# EAGLE design mySatellite_STM (EAGLE 7.6.0)
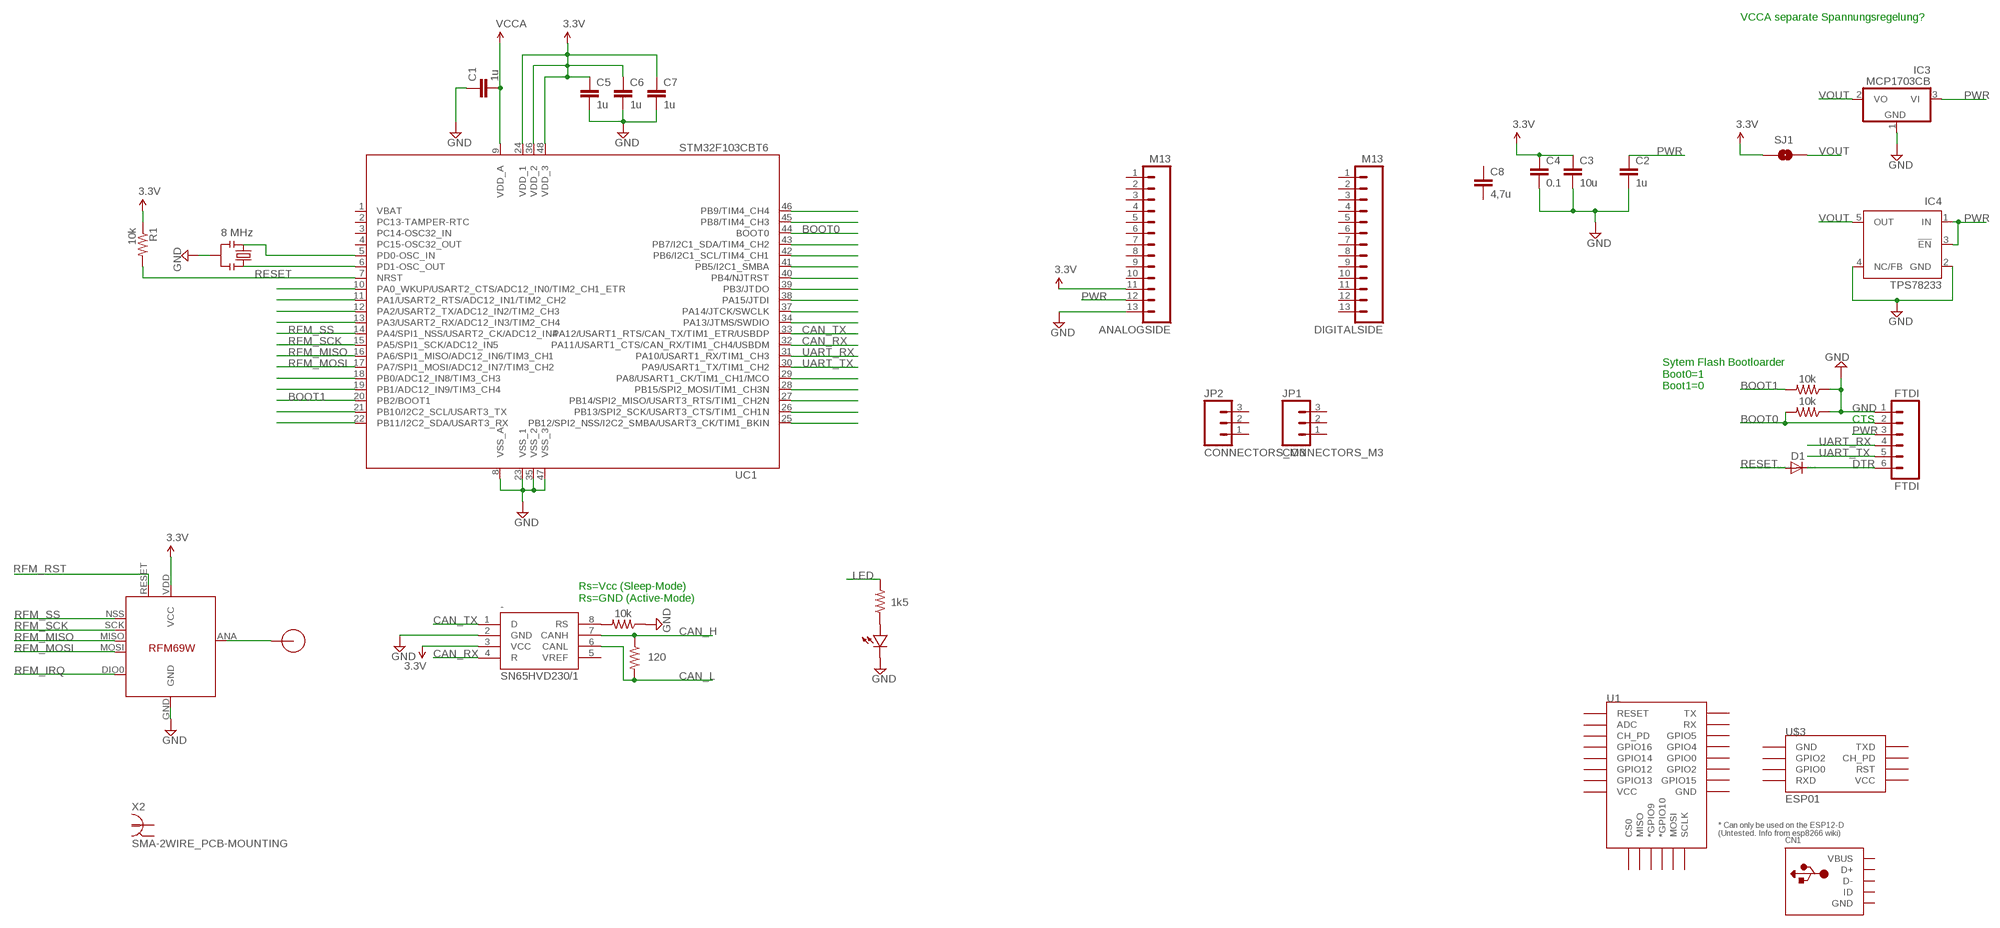
[diagram p0: schematic, sheet 1]

## Parts
-  SN65HVD230/1  [SO8]
ANALOGSIDE  M13  [1X13]
C1  1u  CAP0603-CAP  [0603-CAP]
C2  1u  CAP0603-CAP  [0603-CAP]
C3  10u  CAP0805-CAP  [0805-CAP]
C4  0.1  CAP0603-CAP  [0603-CAP]
C5  1u  CAP0603-CAP  [0603-CAP]
C6  1u  CAP0603-CAP  [0603-CAP]
C7  1u  CAP0603-CAP  [0603-CAP]
C8  4,7u  CAP0805-CAP  [0805-CAP]
CN1  USBMINIB  [USB-MINIB]
D1  DIODE-SOD323-R  [SOD323-R]
DIGITALSIDE  M13  [1X13]
FTDI  FTDI  M06SIP  [1X06]
IC3  MCP1703CB  [SOT23]
IC4  TPS78233  TPS77001  [SOT23-DBV]
JP1  CONNECTORS_M3  [CONNECTORS_1X3]
JP2  CONNECTORS_M3  [CONNECTORS_1X3]
R1  10k  RESISTOR0603-RES  [0603-RES]
R2  1k5  RESISTOR0603-RES  [0603-RES]
R3  10k  RESISTOR0603-RES  [0603-RES]
R4  120  RESISTOR0603-RES  [0603-RES]
R5  10k  RESISTOR0603-RES  [0603-RES]
R7  10k  RESISTOR0603-RES  [0603-RES]
SJ1  SOLDERJUMPERTRACE  [SJ_2S-TRACE]
U1  ESP12ESMD  [ESP12E-SMD]
U$1  RFM12B_ANTENNA  [RFM12B-ANTENNA]
U$2  LED0603  [0603-LED]
U$3  ESP01  [ESP01]
U$5  RFM69_MINIPADS  [RFM69W-MINPADS]
UC1  STM32F103CBT6  STM32F103CB  [LQFP48]
X1  8 MHz  RESONATORSMD  [RESONATOR-SMD]
X2  SMA-2WIRE_PCB-MOUNTING  [J01151A0931]

## Nets
BOOT0: FTDI.2 R5.2 UC1.44(BOOT0)
BOOT1: R7.2 UC1.20(PB2/BOOT1)
CAN_H: -.7(CANH) R4.1
CAN_L: -.6(CANL) R4.2
CAN_RX: -.4(R) UC1.32(PA11/USART1_CTS/CAN_RX/TIM1_CH4/USBDM)
CAN_TX: -.1(D) UC1.33(PA12/USART1_RTS/CAN_TX/TIM1_ETR/USBDP)
DTR: D1.C FTDI.6
GND [power]: -.2(GND) ANALOGSIDE.13 C1.1 C2.2 C3.2 C4.2 C5.2 C6.2 C7.2 FTDI.1 IC3.1(GND) IC4.2(GND) IC4.4(NC/FB) R3.1 R5.1 R7.1 U$2.MINUS U$5.GND UC1.8(VSS_A) UC1.23(VSS_1) UC1.35(VSS_2) UC1.47(VSS_3) X1.2
LED: R2.2
N$1: UC1.29(PA8/USART1_CK/TIM1_CH1/MCO)
N$2: R2.1 U$2.PLUS
N$3: U$1.P$1 U$5.ANA(ANT)
N$4: C1.2 UC1.9(VDD_A) ; supply symbol labelled VCCA
N$5: UC1.45(PB8/TIM4_CH3)
N$6: UC1.5(PD0-OSC_IN) X1.1
N$7: -.8(RS) R3.2
N$8: UC1.6(PD1-OSC_OUT) X1.3
N$9: UC1.34(PA13/JTMS/SWDIO)
N$10: UC1.37(PA14/JTCK/SWCLK)
N$11: UC1.38(PA15/JTDI)
N$12: UC1.28(PB15/SPI2_MOSI/TIM1_CH3N)
N$13: UC1.27(PB14/SPI2_MISO/USART3_RTS/TIM1_CH2N)
N$14: UC1.26(PB13/SPI2_SCK/USART3_CTS/TIM1_CH1N)
N$15: UC1.25(PB12/SPI2_NSS/I2C2_SMBA/USART3_CK/TIM1_BKIN)
N$16: UC1.39(PB3/JTDO)
N$17: UC1.40(PB4/NJTRST)
N$18: UC1.41(PB5/I2C1_SMBA)
N$19: UC1.42(PB6/I2C1_SCL/TIM4_CH1)
N$20: UC1.43(PB7/I2C1_SDA/TIM4_CH2)
N$21: UC1.46(PB9/TIM4_CH4)
N$22: UC1.21(PB10/I2C2_SCL/USART3_TX)
N$23: UC1.22(PB11/I2C2_SDA/USART3_RX)
N$24: UC1.19(PB1/ADC12_IN9/TIM3_CH4)
N$25: UC1.18(PB0/ADC12_IN8/TIM3_CH3)
N$26: UC1.13(PA3/USART2_RX/ADC12_IN3/TIM2_CH4)
N$27: UC1.12(PA2/USART2_TX/ADC12_IN2/TIM2_CH3)
N$28: UC1.11(PA1/USART2_RTS/ADC12_IN1/TIM2_CH2)
N$29: UC1.10(PA0_WKUP/USART2_CTS/ADC12_IN0/TIM2_CH1_ETR)
PWR [power]: ANALOGSIDE.12 C2.1 FTDI.3 IC3.3(VI) IC4.1(IN) IC4.3(!EN)
RESET: D1.A R1.2 UC1.7(NRST)
RFM_IRQ: U$5.DIO0(DIO0/IRQ)
RFM_MISO: U$5.MISO UC1.16(PA6/SPI1_MISO/ADC12_IN6/TIM3_CH1)
RFM_MOSI: U$5.MOSI UC1.17(PA7/SPI1_MOSI/ADC12_IN7/TIM3_CH2)
RFM_RST: U$5.RESET
RFM_SCK: U$5.SCK UC1.15(PA5/SPI1_SCK/ADC12_IN5)
RFM_SS: U$5.NSS(SEL) UC1.14(PA4/SPI1_NSS/USART2_CK/ADC12_IN4)
UART_RX: FTDI.4 UC1.31(PA10/USART1_RX/TIM1_CH3)
UART_TX: FTDI.5 UC1.30(PA9/USART1_TX/TIM1_CH2)
VCC: -.3(VCC) ANALOGSIDE.11 C3.1 C4.1 C5.1 C6.1 C7.1 R1.1 SJ1.1 U$5.VDD(VCC) UC1.24(VDD_1) UC1.36(VDD_2) UC1.48(VDD_3) ; supply symbol labelled 3.3V
VOUT: IC3.2(VO) IC4.5(OUT) SJ1.2
Unconnected: -.5(VREF) ANALOGSIDE.1 ANALOGSIDE.2 ANALOGSIDE.3 ANALOGSIDE.4 ANALOGSIDE.5 ANALOGSIDE.6 ANALOGSIDE.7 ANALOGSIDE.8 ANALOGSIDE.9 ANALOGSIDE.10 C8.1 C8.2 CN1.D+ CN1.D- CN1.ID DIGITALSIDE.1 DIGITALSIDE.2 DIGITALSIDE.3 DIGITALSIDE.4 DIGITALSIDE.5 DIGITALSIDE.6 DIGITALSIDE.7 DIGITALSIDE.8 DIGITALSIDE.9 DIGITALSIDE.10 DIGITALSIDE.11 DIGITALSIDE.12 DIGITALSIDE.13 JP1.1 JP1.2 JP1.3 JP2.1 JP2.2 JP2.3 U1.ADC U1.CH_PD U1.CS0 U1.GND U1.GPIO0 U1.GPIO2 U1.GPIO4 U1.GPIO5 U1.GPIO9(*GPIO9) U1.GPIO10(*GPIO10) U1.GPIO12 U1.GPIO13 U1.GPIO14 U1.GPIO15 U1.GPIO16 U1.MISO U1.MOSI U1.RESET U1.RXD0(RX) U1.SCLK U1.TXD0(TX) U1.VCC U$3.CH_PD U$3.GND U$3.GPIO0 U$3.GPIO2 U$3.RST U$3.RX(RXD) U$3.TX(TXD) U$3.VCC UC1.2(PC13-TAMPER-RTC) UC1.3(PC14-OSC32_IN) UC1.4(PC15-OSC32_OUT) X2.1 X2.G@1 X2.G@2 X2.G@3 X2.G@4

## Notes on the sheet
- VCCA separate Spannungsregelung?
- Sytem Flash Bootloarder
  Boot0=1
  Boot1=0
- CTS
- Rs=Vcc (Sleep-Mode)
  Rs=GND (Active-Mode)

## Power pins joined to a net without a drawn wire
GND: CN1.GND
VBAT: UC1.1(VBAT)
VBUS: CN1.VBUS

## Library data of the parts
- = texas_instruments:SN65HVD230/1; EBAY: SN65HVD231
ANALOGSIDE DIGITALSIDE = SparkFun-Connectors:M13: 13-pin single row .1" header; BUERKLIN: 59 F 2140
C1 C2 C5-C7 = LowPowerLab:CAP: Capacitor Standard 0603 ceramic capacitor, and 0.1" leaded capacitor.; BUERKLIN: 53D1660
C3 = LowPowerLab:CAP: Capacitor Standard 0603 ceramic capacitor, and 0.1" leaded capacitor.; BUERKLIN: 53 D 2432
C4 = LowPowerLab:CAP: Capacitor Standard 0603 ceramic capacitor, and 0.1" leaded capacitor.; BUERKLIN: 53 D 1726
C8 = LowPowerLab:CAP: Capacitor Standard 0603 ceramic capacitor, and 0.1" leaded capacitor.; BUERKLIN: 53 D 2431
CN1 = myLib:USB: USB Connectors USBMINIB - Surface Mount Female Mini-B USB Connector 4UConnector: 06564 By microbuilder.eu Thru-hole RA Female Mini-B USB Connector 4UConnector: 18732 By ladyada.net
D1 = diode:DIODE-: DIODE; BUERKLIN: 34 S 1216
FTDI = SparkFun-Connectors:M06: Header 6 Standard 6-pin 0.1" header. Use with straight break away headers (SKU : PRT-00116), right angle break away headers (PRT-00553), swiss pins (PRT-00743), machine pins (PRT-00117), and female headers (PRT-00115). Molex polarized connector foot print use with SKU : PRT-08094 with associated crimp pins and housings. NOTES ON THE VARIANTS LOCK and LOCK_LONGPADS... This footprint was designed to help hold the alignment of a through-hole component (i.e. 6-pin header) while soldering it into place. You may notice that each hole has been shifted either up or down by 0.005 of an inch from it's more standard position (which is a perfectly straight line). This slight alteration caused the pins (the squares in the middle) to touch the edges of the holes. Because they are alternating, it causes a "brace" to hold the component in place. 0.005 has proven to be the perfect amount of "off-center" position when using our standard breakaway headers. Although looks a little odd when you look at the bare footprint, once you have a header in there, the alteration is very hard to notice. Also, if you push a header all the way into place, it is covered up entirely on the bottom side. This idea of altering the position of holes to aid alignment will be further integrated into the Sparkfun Library for other footprints. It can help hold any component with 3 or more connection pins.; BUERKLIN: 59 F 2134
IC3 = linear:MCP1703: 250 mA, 16V, Low Quiescent Current LDO Regulator Source: http://ww1.microchip.com/downloads/en/DeviceDoc/22049b.pdf; CONRAD: 651422-62
IC4 = texas:TPS770*: ULTRALOW-POWER 50-mA LOW-DROPOUT LINEAR REGULATORS 50-mA Low-Dropout Regulator Source: http://focus.ti.com/lit/ds/symlink/tps77001.pdf; MF: TEXAS INSTRUMENTS; MPN: TPS77001DBVT; OC_FARNELL: 8461554; OC_NEWARK: 77C1171
JP1 JP2 = myLib:CONNECTORS_M3: 13-pin single row .1" header
R1 R3 R5 R7 = LowPowerLab:RESISTOR: Resistor Basic schematic elements and footprints for 0603, 1206, and PTH resistors.; BUERKLIN: 26 E 816
R2 = LowPowerLab:RESISTOR: Resistor Basic schematic elements and footprints for 0603, 1206, and PTH resistors.; BUERKLIN: 26 E 796
R4 = LowPowerLab:RESISTOR: Resistor Basic schematic elements and footprints for 0603, 1206, and PTH resistors.; BUERKLIN: 26 E 770
SJ1 = SparkFun-Retired:SOLDERJUMPER: Solder Jumper Standard SMD solder jumper. Used to automate production. Two varients : Normally Open and Normally Closed are the same, but have different paste layers. NC will have a large amount of paste and should jumper during reflow.
U1 = esp8266modules:ESP12E: ESP12E Module
U$1 = LowPowerLab:RFM12B_ANTENNA
U$2 = LowPowerLab:LED; BUERKLIN: 66 S 9766
U$3 = esp8266modules:ESP01: ESP8266 Wifi module 01
U$5 = myLib:RFM69_MINIPADS
UC1 = stm32:STM32F103CB; BUERKLIN_128KB: 51 S 2353; BUERKLIN_64KB: 51 S 2352
X1 = SparkFun:RESONATOR: Resonator Small SMD resonator. This is the itty bitty 10/20MHz resonators with built in caps. CSTCE10M0G55 and CSTCE20M0V53. Footprint has been reviewed closely but hasn't been tested yet.
X2 = myLib:SMA-2WIRE_PCB-MOUNTING: SMA 50 Ohm Straight Jack Receptacle - PCB Mountung www.telegaertner.de Source: Buerklin Artikelnummer: J01151A0931; BUERKLIN: 76F410

## Net classes
0 default: width 0.305 mm, clearance 0.254 mm
1 power: width 0.381 mm, clearance 0.254 mm

## Board
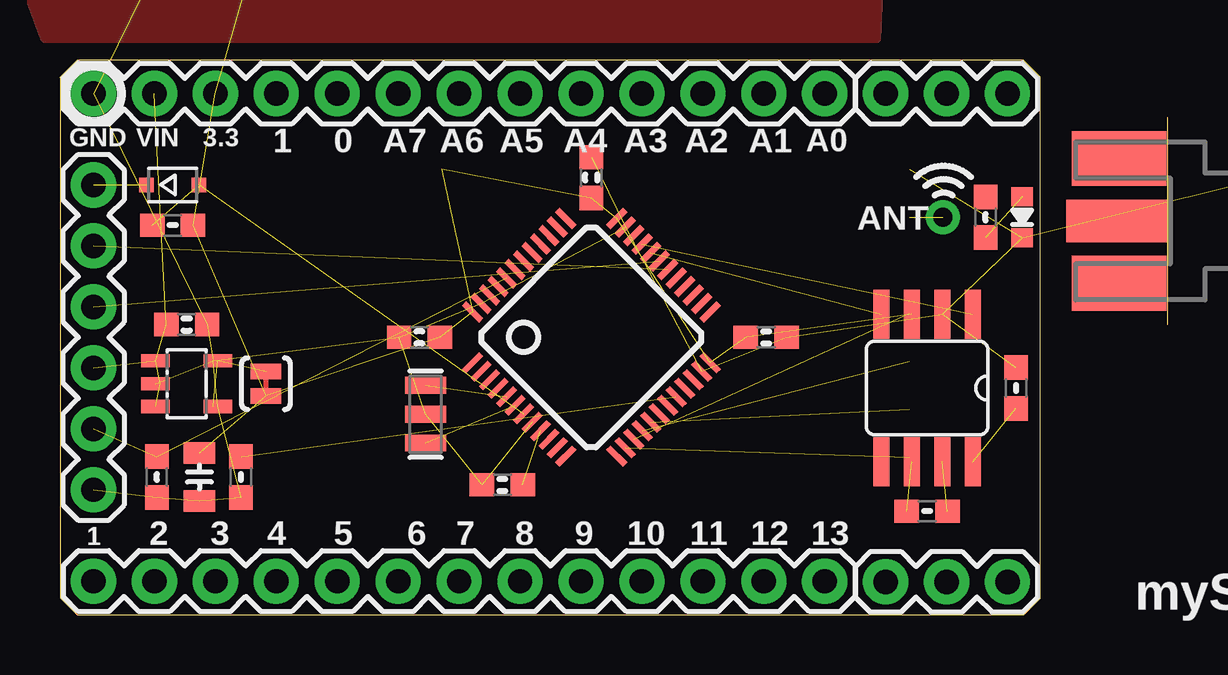
[diagram p1: board, top side]
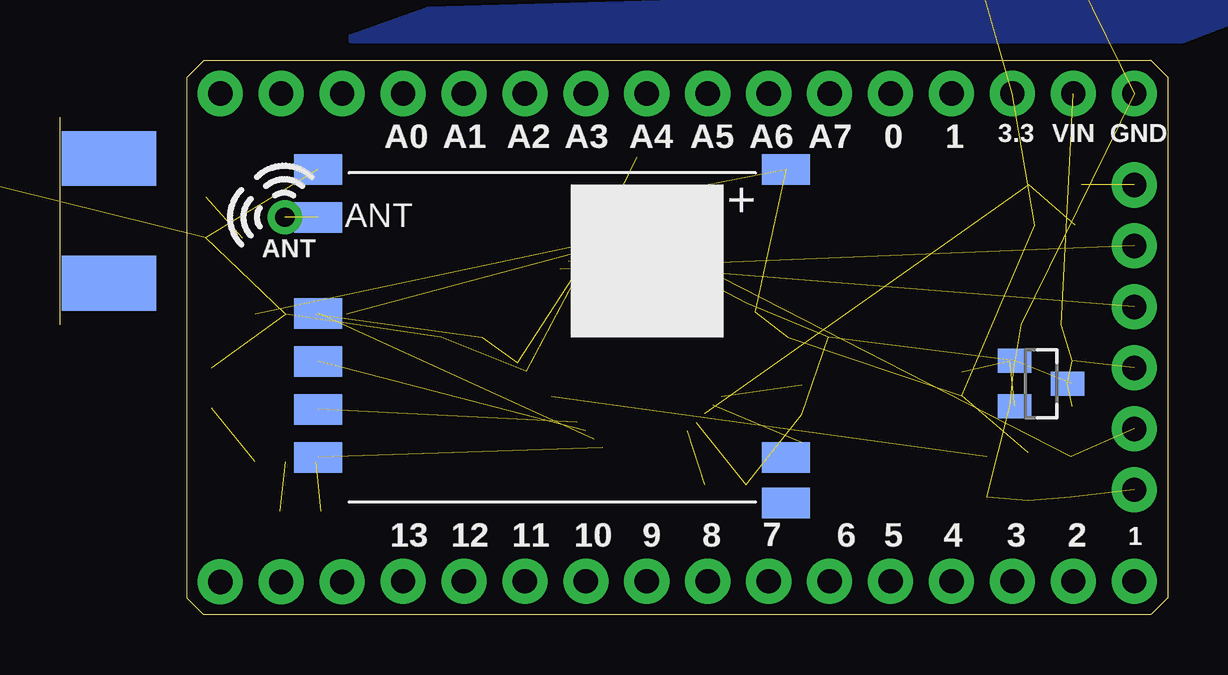
[diagram p2: board, bottom side, seen from below]

Size 40.87 x 23.11 mm. Coordinates in mm from the lower left corner, seen from the top.
Outline: 0.71,0 40.18,0 40.87,0.69 40.87,22.4 40.16,23.11 0.71,23.11 0,22.4 0,0.71 0.71,0
Copper layers (1*16): Top 0.0356mm / dielectric 1.5011mm / Bottom 0.0356mm
Design rules "oshpark-2layer *": minimum track width 6mil, minimum drill 13mil, track to track 6mil, track to pad 6mil, pad to pad 6mil, via to via 6mil, smd to smd 6mil, copper to edge 15mil, drill to drill 6mil, minimum pad ring 7mil, minimum via ring 7mil, stop-mask expansion 2.5mil, vias tented up to drill 100mil, thermal gap 10mil
tRestrict: area 24.3,8.9 to 29.1,12.8
bRestrict: area 26.5,17.9 to 27.1,18.5

### Footprints (pad centres in the part's own frame; a part is rotated, then mirrored left to right if it is on the bottom)
SO8 = smd 0.66 x 2.032: 1 -1.905,-3.073; 2 -0.635,-3.073; 3 0.635,-3.073; 4 1.905,-3.073; 5 1.905,3.073; 6 0.635,3.073; 7 -0.635,3.073; 8 -1.905,3.073
1X13 = drill 1.016 pad 1.88: 1 0,0; 2 2.54,0; 3 5.08,0; 4 7.62,0; 5 10.16,0; 6 12.7,0; 7 15.24,0; 8 17.78,0; 9 20.32,0; 10 22.86,0; 11 25.4,0; 12 27.94,0; 13 30.48,0
0603-CAP = smd 1.016 x 0.965: 1 -0.85,0; 2 0.85,0
0805-CAP = smd 0.902 x 1.3: 1 -1,0; 2 1,0
USB-MINIB = smd 0.5 x 2.308: D+ 0,4.064; D- -0.8,4.064; GND 1.6,4.064; ID 0.8,4.064; VBUS -1.6,4.064 | smd 2 x 2.4: GND1 -4.4,-2; GND2 -4.4,3.5; GND3 4.4,3.5; GND4 4.4,-2 | hole 1: -2.2,1; 2.2,1
SOD323-R = smd 0.6 x 0.6: A 1.1,0; C -1.1,0
1X06 = drill 1.016 pad 1.88: 1 0,0; 2 2.54,0; 3 5.08,0; 4 7.62,0; 5 10.16,0; 6 12.7,0
SOT23 = smd 1 x 1.4: 1 -0.95,-1.1; 2 0.95,-1.1; 3 0,1.1
SOT23-DBV = smd 0.55 x 1.2: 1 -0.95,-1.3; 2 0,-1.3; 3 0.95,-1.3; 4 0.95,1.3; 5 -0.95,1.3
CONNECTORS_1X3 = drill 1.016 pad 1.88: 1 0,0; 2 2.54,0; 3 5.08,0
0603-RES = smd 1.016 x 0.965: 1 -0.85,0; 2 0.85,0
SJ_2S-TRACE = smd 0.635 x 1.27: 1 -0.508,0; 2 0.508,0
ESP12E-SMD = smd 3 x 1.2: ADC -8.3,3.8; CH_PD -8.3,1.8; GND 8.1,-8.2; GPIO0 8.1,-2.2; GPIO2 8.1,-4.2; GPIO4 8.1,-0.2; GPIO5 8.1,1.8; GPIO12 -8.3,-4.2; GPIO13 -8.3,-6.2; GPIO14 -8.3,-2.2; GPIO15 8.1,-6.2; GPIO16 -8.3,-0.2; RESET -8.3,5.8; RXD0 8.1,3.8; TXD0 8.1,5.8; VCC -8.3,-8.2 | smd 1.2 x 3: CS0 -4.8,-10.3; GPIO9 -0.8,-10.3; GPIO10 1.2,-10.3; MISO -2.8,-10.3; MOSI 3.2,-10.3; SCLK 5.2,-10.3
RFM12B-ANTENNA = drill 0.8 pad 1.422: P$1 0,0
0603-LED = smd 0.8 x 0.9: MINUS -0.85,0; PLUS 0.85,0
ESP01 = drill 0.8: CH_PD -1.285,-8.178; GPIO0 1.255,-5.638; GPIO2 -1.285,-5.638; RST 1.255,-8.178; TX -3.825,-8.178; VCC 3.795,-8.178 | drill 0.8 square: GND -3.825,-5.638; RX 3.795,-5.638
RFM69W-MINPADS = smd 2 x 1.27: ANA 8,-5; DIO0 -11.5,5; GND 8,-7; MISO 8,1; MOSI 8,3; NSS 8,5; RESET -11.5,6.909; SCK 8,-1; VDD -11.5,-7
LQFP48 = smd 0.254 x 1: 1 -2.75,-4.25; 2 -2.25,-4.25; 3 -1.75,-4.25; 4 -1.25,-4.25; 5 -0.75,-4.25; 6 -0.25,-4.25; 7 0.25,-4.25; 8 0.75,-4.25; 9 1.25,-4.25; 10 1.75,-4.25; 11 2.25,-4.25; 12 2.75,-4.25; 25 2.75,4.25; 26 2.25,4.25; 27 1.75,4.25; 28 1.25,4.25; 29 0.75,4.25; 30 0.25,4.25; 31 -0.25,4.25; 32 -0.75,4.25; 33 -1.25,4.25; 34 -1.75,4.25; 35 -2.25,4.25; 36 -2.75,4.25 | smd 1 x 0.254: 13 4.25,-2.75; 14 4.25,-2.25; 15 4.25,-1.75; 16 4.25,-1.25; 17 4.25,-0.75; 18 4.25,-0.25; 19 4.25,0.25; 20 4.25,0.75; 21 4.25,1.25; 22 4.25,1.75; 23 4.25,2.25; 24 4.25,2.75; 37 -4.25,2.75; 38 -4.25,2.25; 39 -4.25,1.75; 40 -4.25,1.25; 41 -4.25,0.75; 42 -4.25,0.25; 43 -4.25,-0.25; 44 -4.25,-0.75; 45 -4.25,-1.25; 46 -4.25,-1.75; 47 -4.25,-2.25; 48 -4.25,-2.75
RESONATOR-SMD = smd 0.7 x 1.7: 1 -1.2,0; 2 0,0; 3 1.2,0
J01151A0931 = smd 4.191 x 1.778: 1 2.134,0 | smd 3.937 x 2.286: G@1 2.032,2.6; G@2 2.032,-2.6 | smd 3.937 x 2.286 bottom: G@3 2.032,2.6; G@4 2.032,-2.6

### Placement (x,y rotation side)
-  36.14,9.45 180 top
ANALOGSIDE  31.88,21.72 180 top
C1  18.44,5.41 0 top
C2  5.28,12.09 0 top
C3  5.82,5.74 270 top
C4  10.39,38.3 180 top  (outside the outline)
C5  22.15,18.21 90 top
C6  29.44,11.56 0 top
C7  14.99,11.56 180 top
C8  -5,-1.68 0 top  (outside the outline)
CN1  93.45,26.31 90 top  (outside the outline)
D1  4.7,17.91 0 top
DIGITALSIDE  31.88,1.4 180 top
FTDI  1.4,5.21 90 top
IC3  5.28,9.63 270 bottom
IC4  5.28,9.63 270 top
JP1  34.42,1.37 0 top
JP2  34.42,21.72 0 top
R1  4.7,16.23 180 top
R2  38.58,16.56 90 top
R3  39.85,9.45 270 top
R4  36.14,4.32 180 top
R5  4.04,5.74 90 top
R7  7.54,5.74 90 top
SJ1  8.59,9.63 90 top
U1  64.62,10.69 90 bottom  (outside the outline)
U$1  36.8,16.56 270 top
U$2  40.11,16.56 90 top
U$3  62.59,28.93 270 top  (outside the outline)
U$5  27.41,11.56 180 bottom
UC1  22.15,11.56 315 top
X1  15.24,8.36 270 top
X2  46.18,16.41 180 top  (outside the outline)

### Tracks (layer width: path | path; a pad name or v marks a point on that pad's centre or on a via)
BOOT0  (2 unrouted)
BOOT1  (1 unrouted)
CAN_H  (1 unrouted)
CAN_L  (1 unrouted)
CAN_RX  (1 unrouted)
CAN_TX  (1 unrouted)
DTR  (1 unrouted)
GND  (23 unrouted)
  pour Bottom: -0.64,24 -6.35,26.21 30.81,25.15 34.04,24
  pour Top: -0.64,24 -1.57,26.57 34.16,26.7 34.04,24
N$2  (1 unrouted)
N$3  (1 unrouted)
N$4  (1 unrouted)
N$6  (1 unrouted)
N$7  (1 unrouted)
N$8  (1 unrouted)
PWR  (5 unrouted)
RESET  (2 unrouted)
RFM_MISO  (1 unrouted)
RFM_MOSI  (1 unrouted)
RFM_SCK  (1 unrouted)
RFM_SS  (1 unrouted)
UART_RX  (1 unrouted)
UART_TX  (1 unrouted)
VCC  (12 unrouted)
VOUT  (2 unrouted)

### Text on the board
tPlace: mySatellite
tDocu: REG
_tsilk: GND | VIN | 3.3 | 1 | 0 | A7 | A6 | A5 | A4 | A3 | A2 | A1 | A0 | ANT | 2 | 3 | 4 | 5 | 6 | 7 | 8 | 9 | 10 | 11 | 12 | 13 | 1
_bsilk: GND | VIN | 3.3 | 1 | 0 | A7 | A6 | A5 | A4 | A3 | A2 | A1 | A0 | ANT | 2 | 3 | 4 | 5 | 6 | 7 | 8 | 9 | 10 | 11 | 12 | 13 | 1